# Altium schematic sheet Sheet3.SchDoc
size 420 x 297 mm; DocumentNumber: ЭАЕСН.464512.003Э3; SheetNumber: 3; SheetTotal: x; DocumentName: Sheet1.SCHDOC
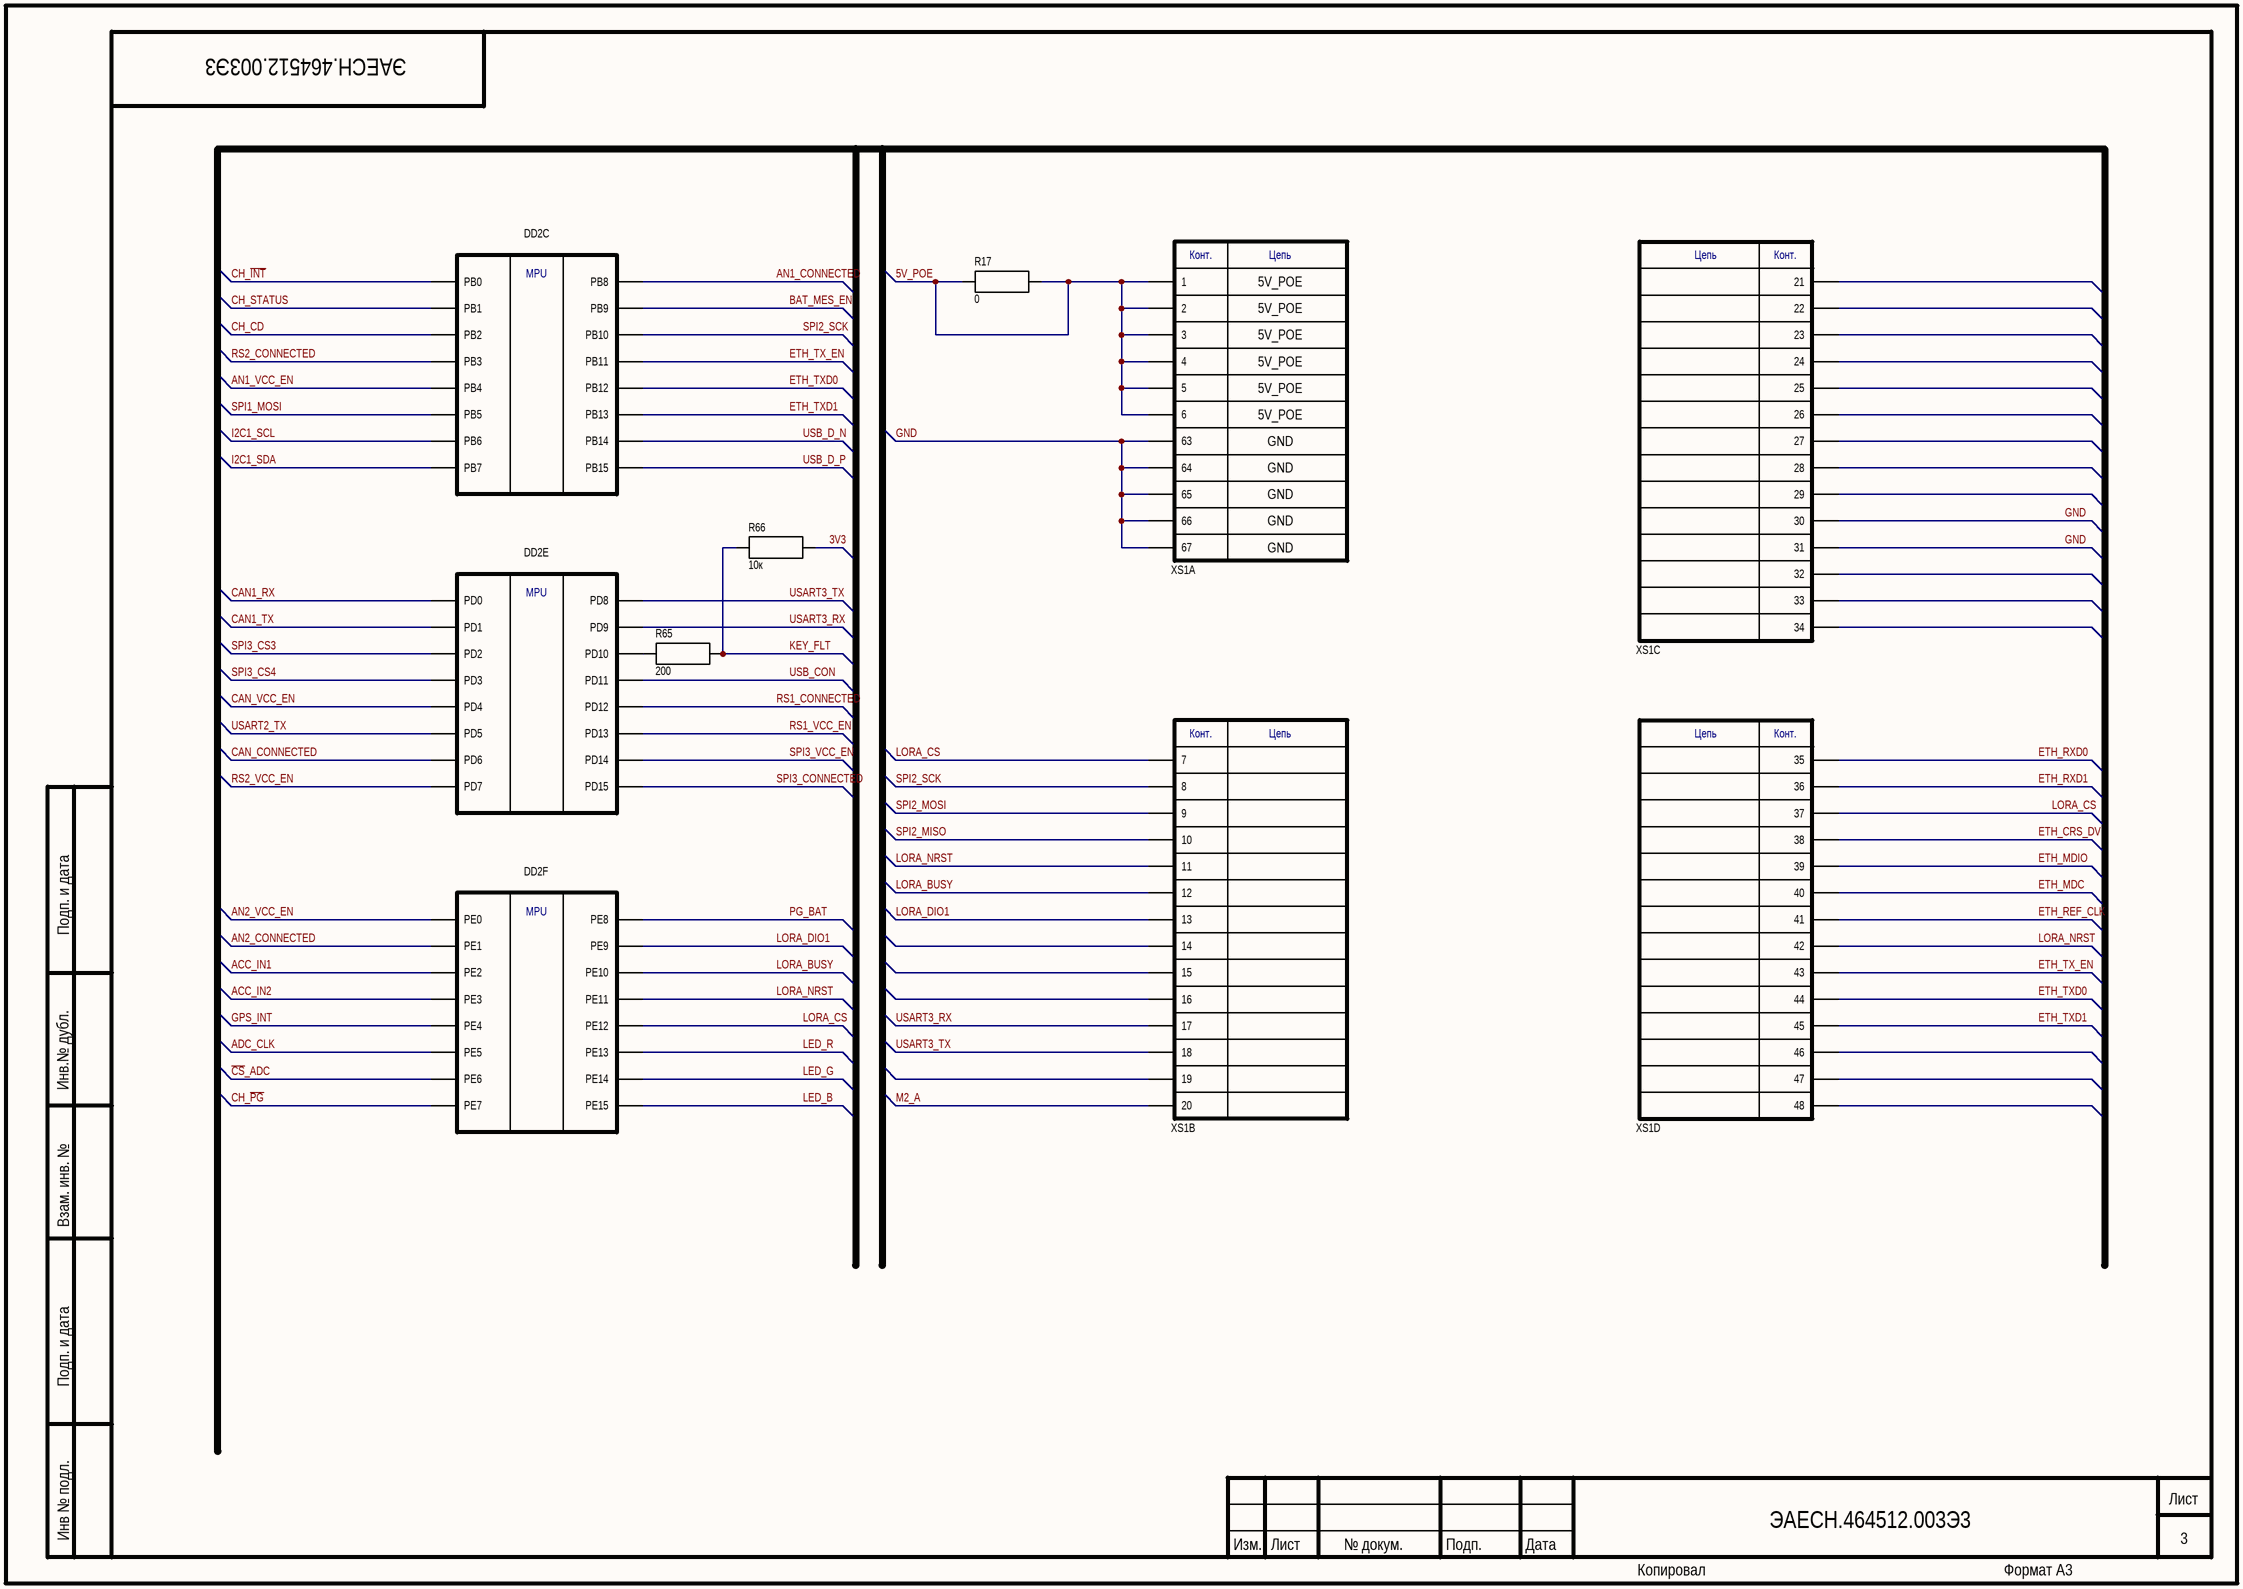
[diagram p0: Sheet3.SchDoc]

## Parts
DD2  STM32F207VCTx  [LQFP100]  (value not drawn)  (parts C,E,F of 6)
R17  value 0  [R1206]  (hidden comment: R)
R65  value 200  [R0603]  (hidden comment: R)
R66  value 10к  [R0603]  (hidden comment: R)
XS1  M.2  [M.2]  (value not drawn)  (parts A,B,C,D of 5)

## Nets
3V3: R66.2
5V_POE: R17.1 R17.2 XS1.1 XS1.2 XS1.3 XS1.4 XS1.5 XS1.6
ACC_IN1: DD2.1(PE2)
ACC_IN2: DD2.2(PE3)
ADC_CLK: DD2.4(PE5)
AN1_CONNECTED: DD2.95(PB8)
AN1_VCC_EN: DD2.90(PB4)
AN2_CONNECTED: DD2.98(PE1)
AN2_VCC_EN: DD2.97(PE0)
BAT_MES_EN: DD2.96(PB9)
~{CS}_ADC: DD2.5(PE6)
CAN1_RX: DD2.81(PD0)
CAN1_TX: DD2.82(PD1)
CAN_CONNECTED: DD2.87(PD6)
CAN_VCC_EN: DD2.85(PD4)
CH_CD: DD2.37(PB2)
CH_~{INT}: DD2.35(PB0)
CH_~{PG}: DD2.38(PE7)
CH_STATUS: DD2.36(PB1)
ETH_CRS_DV: XS1.38
ETH_MDC: XS1.40
ETH_MDIO: XS1.39
ETH_REF_CLK: XS1.41
ETH_RXD0: XS1.35
ETH_RXD1: XS1.36
ETH_TX_EN: DD2.48(PB11) XS1.43
ETH_TXD0: DD2.51(PB12) XS1.44
ETH_TXD1: DD2.52(PB13) XS1.45
GND: XS1.30 XS1.31 XS1.63 XS1.64 XS1.65 XS1.66 XS1.67
GPS_INT: DD2.3(PE4)
I2C1_SCL: DD2.92(PB6)
I2C1_SDA: DD2.93(PB7)
KEY_FLT: R65.2 R66.1
LED_B: DD2.46(PE15)
LED_G: DD2.45(PE14)
LED_R: DD2.44(PE13)
LORA_BUSY: DD2.41(PE10) XS1.12
LORA_CS: DD2.43(PE12) XS1.7 XS1.37
LORA_DIO1: DD2.40(PE9) XS1.13
LORA_NRST: DD2.42(PE11) XS1.11 XS1.42
M2_A: XS1.20
PG_BAT: DD2.39(PE8)
RS1_CONNECTED: DD2.59(PD12)
RS1_VCC_EN: DD2.60(PD13)
RS2_CONNECTED: DD2.89(PB3)
RS2_VCC_EN: DD2.88(PD7)
SPI1_MOSI: DD2.91(PB5)
SPI2_MISO: XS1.10
SPI2_MOSI: XS1.9
SPI2_SCK: DD2.47(PB10) XS1.8
SPI3_CONNECTED: DD2.62(PD15)
SPI3_CS3: DD2.83(PD2)
SPI3_CS4: DD2.84(PD3)
SPI3_VCC_EN: DD2.61(PD14)
USART2_TX: DD2.86(PD5)
USART3_RX: DD2.56(PD9) XS1.17
USART3_TX: DD2.55(PD8) XS1.18
USB_CON: DD2.58(PD11)
USB_D_N: DD2.53(PB14)
USB_D_P: DD2.54(PB15)
NetDD2_57: DD2.57(PD10) R65.1

Not connected (* = marked no-connect by the designer): XS1 14 15 16 19 21 22 23 24 25 26 27 28 29 32 33 34 46 47 48

## Notes on the sheet
- 5V_POE
- GND
- Подп. и дата
- Инв.№ дубл.
- Взам. инв. №
- Инв № подл.
- Изм.
- Лист
- № докум.
- Подп.
- Дата
- Копировал
- Формат А3
- (in symbol M.2, part A) Конт.; Цепь
- (in symbol M.2, part B) Конт.; Цепь
- (in symbol M.2, part C) Цепь; Конт.
- (in symbol M.2, part D) Цепь; Конт.
- (in symbol STM32F207VCTx, part C) MPU
- (in symbol STM32F207VCTx, part E) MPU
- (in symbol STM32F207VCTx, part F) MPU